# EAGLE design picopter_qc (EAGLE 6.5.0)
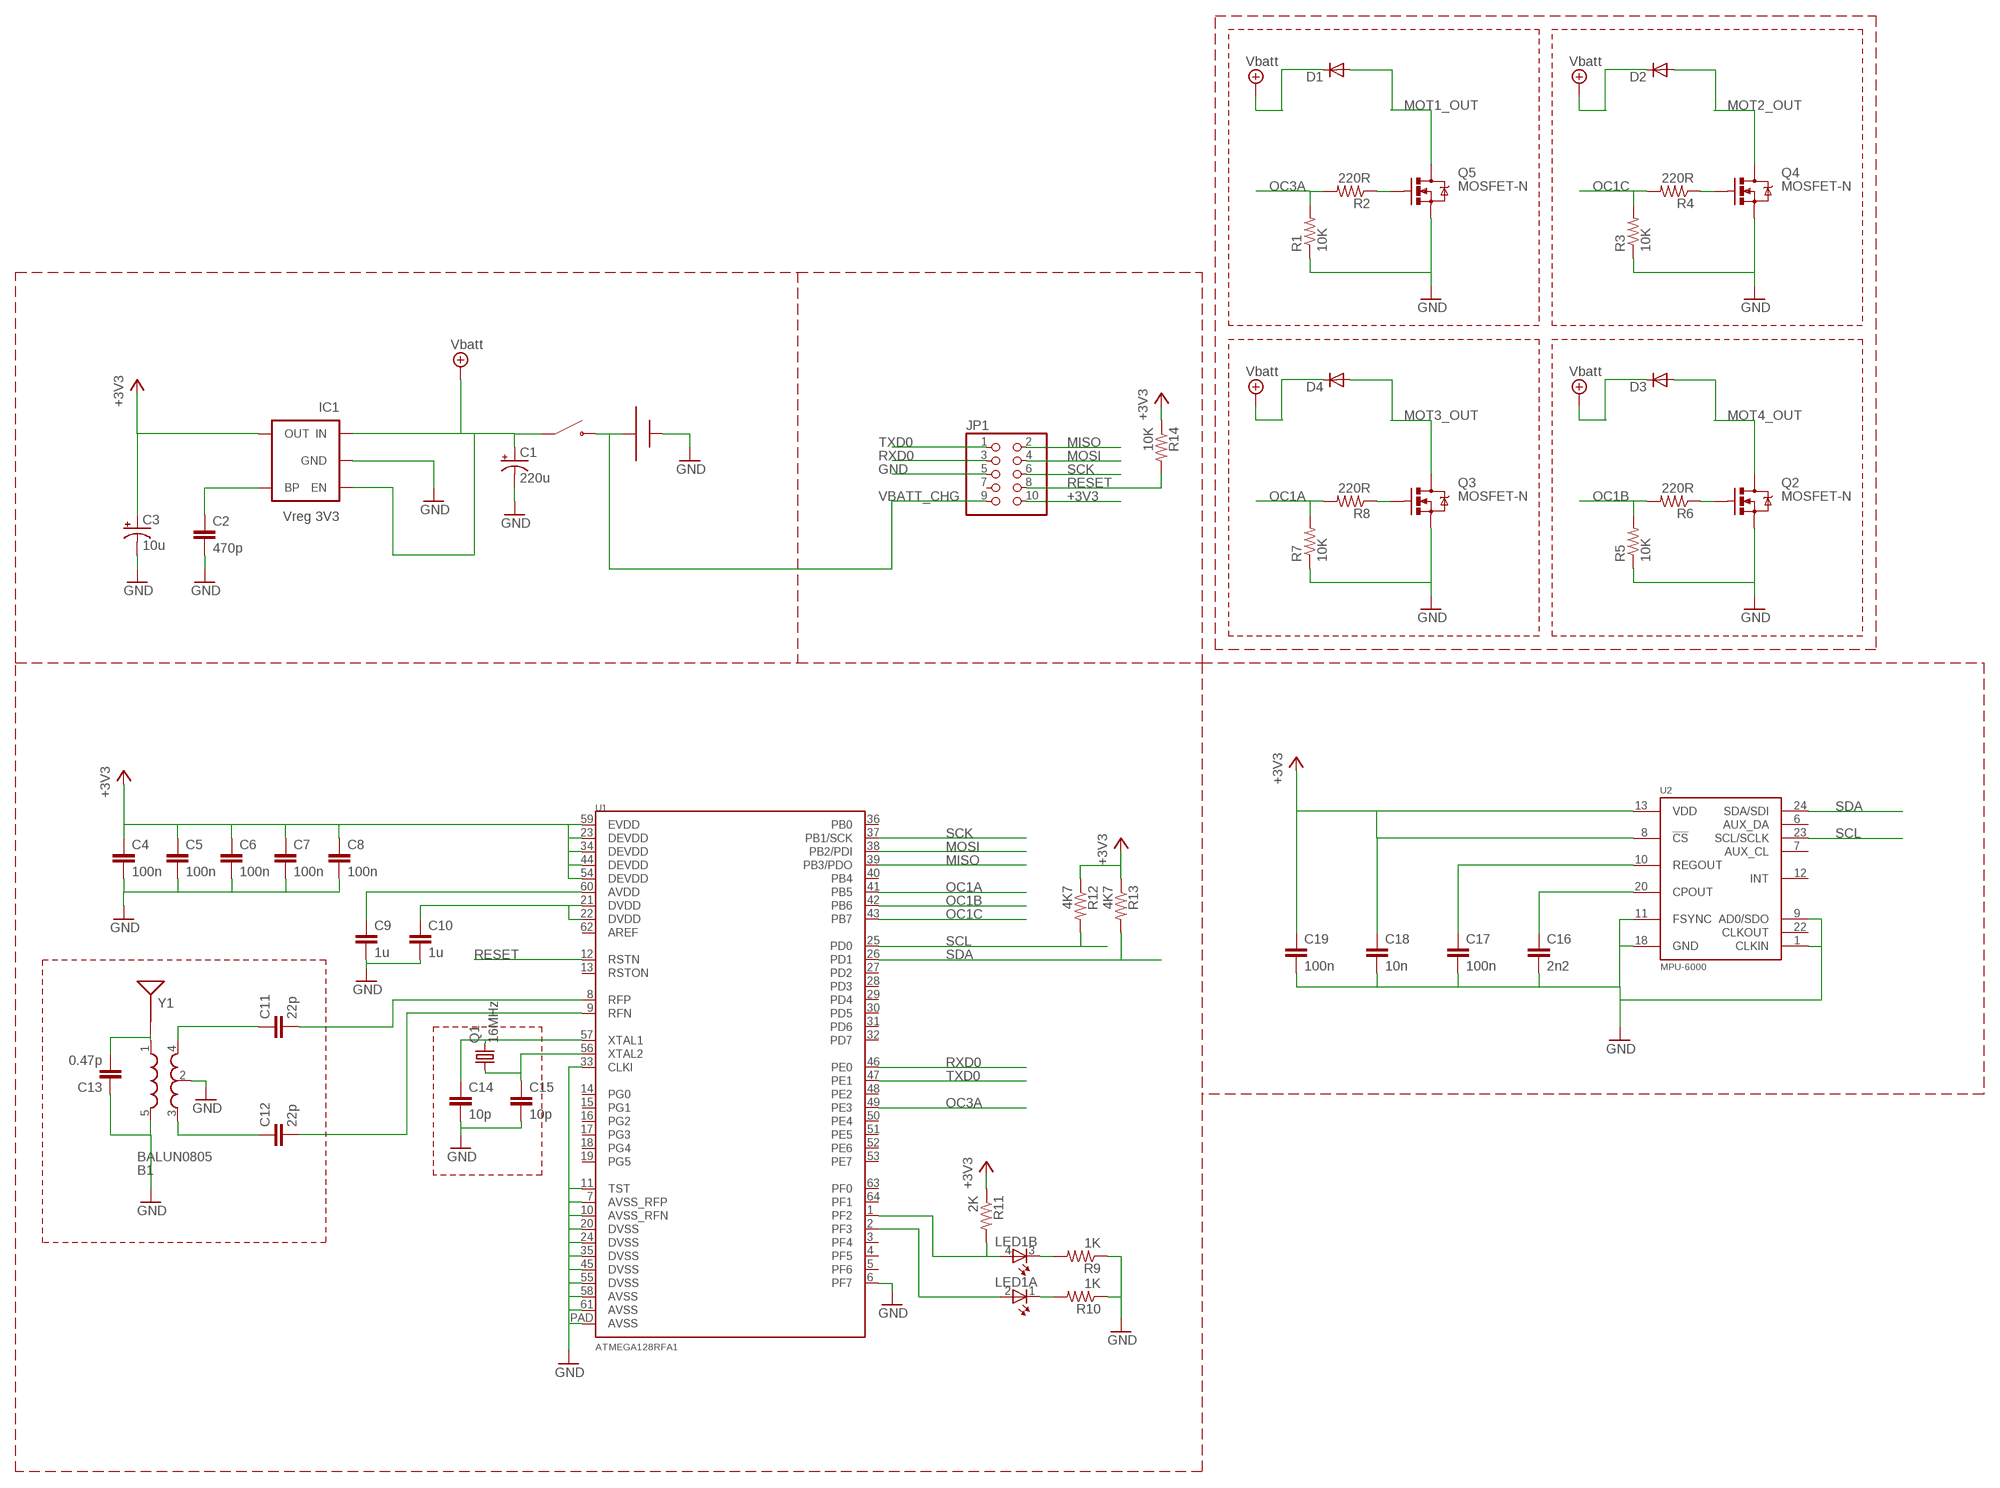
[diagram p0: schematic, sheet 1]

## Parts
B1  BALUN0805  [BALUN]
BATT1  BATT-CONNJST-PH-VERT  [JST-PH-2-VERT]
C1  220u  CPOL-USSMCB  [SMC_B]
C2  470p  C-EUC0603  [C0603]
C3  10u  CPOL-USSMCB  [SMC_B]
C4  100n  C-EUC0603  [C0603]
C5  100n  C-EUC0603  [C0603]
C6  100n  C-EUC0603  [C0603]
C7  100n  C-EUC0603  [C0603]
C8  100n  C-EUC0603  [C0603]
C9  1u  C-EUC0603  [C0603]
C10  1u  C-EUC0603  [C0603]
C11  22p  C-EUC0603  [C0603]
C12  22p  C-EUC0603  [C0603]
C13  0.47p  C-EUC0603  [C0603]
C14  10p  C-EUC0603  [C0603]
C15  10p  C-EUC0603  [C0603]
C16  2n2  C-EUC0603  [C0603]
C17  100n  C-EUC0603  [C0603]
C18  10n  C-EUC0603  [C0603]
C19  100n  C-EUC0603  [C0603]
D1  DIODE-MINIMELF  [MINIMELF]
D2  DIODE-MINIMELF  [MINIMELF]
D3  DIODE-MINIMELF  [MINIMELF]
D4  DIODE-MINIMELF  [MINIMELF]
IC1  Vreg 3V3  V_REG_LDOSMD  [SOT23-5]
JP1  PINHD-2X5EDGE  [2X5-EDGE]
LED1  TOPLED-2-CUSTOM  [TOPLED2CUSTOM]
Q1  16MHz  CRYSTALCTS406  [CTS406]
Q2  MOSFET-N  MOSFET-NCHANNELSMD  [SOT23-3]
Q3  MOSFET-N  MOSFET-NCHANNELSMD  [SOT23-3]
Q4  MOSFET-N  MOSFET-NCHANNELSMD  [SOT23-3]
Q5  MOSFET-N  MOSFET-NCHANNELSMD  [SOT23-3]
R1  10K  R-US_R0603  [R0603]
R2  220R  R-US_R0603  [R0603]
R3  10K  R-US_R0603  [R0603]
R4  220R  R-US_R0603  [R0603]
R5  10K  R-US_R0603  [R0603]
R6  220R  R-US_R0603  [R0603]
R7  10K  R-US_R0603  [R0603]
R8  220R  R-US_R0603  [R0603]
R9  1K  R-US_R0603  [R0603]
R10  1K  R-US_R0603  [R0603]
R11  2K  R-US_R0603  [R0603]
R12  4K7  R-US_R0603  [R0603]
R13  4K7  R-US_R0603  [R0603]
R14  10K  R-US_R0603  [R0603]
S2  SWITCH-PWR-SIMPLE  [SWITCH-PWR]
U1  ATMEGA128RFA1  [QFN-64]
U2  MPU-6000  [QFN-24]
Y1  ANTENNA2SMD5  [ANTENNA-CHIP5]

## Nets
+3V3: C3.+ C4.1 C5.1 C6.1 C7.1 C8.1 C18.1 C19.1 IC1.5(OUT) JP1.10 R11.1 R12.1 R13.1 R14.1 U1.23(DEVDD) U1.34(DEVDD) U1.44(DEVDD) U1.54(DEVDD) U1.59(EVDD) U2.8(!CS) U2.13(VDD)
GND: B1.2(GND) B1.5(GND) BATT1.N C1.- C2.2 C3.- C4.2 C5.2 C6.2 C7.2 C8.2 C9.2 C10.2 C13.1 C14.2 C15.2 C16.2 C17.2 C18.2 C19.2 IC1.2(GND) JP1.5 Q2.2(S) Q3.2(S) Q4.2(S) Q5.2(S) R1.1 R3.1 R5.1 R7.1 R9.1 R10.1 U1.6(PF7) U1.7(AVSS_RFP) U1.10(AVSS_RFN) U1.11(TST) U1.20(DVSS) U1.24(DVSS) U1.33(CLKI) U1.35(DVSS) U1.45(DVSS) U1.55(DVSS) U1.58(AVSS) U1.61(AVSS) U1.PAD(AVSS) U2.1(CLKIN) U2.9(AD0/SDO) U2.11(FSYNC) U2.18(GND)
MISO: JP1.2 U1.39(PB3/PDO)
MOSI: JP1.4 U1.38(PB2/PDI)
MOT1_OUT: D1.A Q5.3(D)
MOT2_OUT: D2.A Q4.3(D)
MOT3_OUT: D4.A Q3.3(D)
MOT4_OUT: D3.A Q2.3(D)
MS1: B1.1(IN) C13.2 Y1.FEED(SIGNAL)
N$1: C2.1 IC1.4(BP)
N$2: LED1.4(B:A) R11.2 U1.1(PF2)
N$3: C11.2 U1.8(RFP)
N$4: C10.1 U1.21(DVDD) U1.22(DVDD)
N$5: C9.1 U1.60(AVDD)
N$6: B1.3(OUT1) C12.1
N$7: B1.4(OUT2) C11.1
N$8: C12.2 U1.9(RFN)
N$9: C14.1 Q1.3 U1.57(XTAL1)
N$10: C15.1 Q1.1 U1.56(XTAL2)
N$11: LED1.3(B:C) R9.2
N$12: LED1.1(A:C) R10.2
N$13: LED1.2(A:A) U1.2(PF3)
N$16: C16.1 U2.20(CPOUT)
N$17: C17.1 U2.10(REGOUT)
N$45: Q5.1(G) R2.1
N$46: Q4.1(G) R4.1
N$47: Q2.1(G) R6.1
N$48: Q3.1(G) R8.1
OC1A: R7.2 R8.2 U1.41(PB5)
OC1B: R5.2 R6.2 U1.42(PB6)
OC1C: R3.2 R4.2 U1.43(PB7)
OC3A: R1.2 R2.2 U1.49(PE3)
RESET: JP1.8 R14.2 U1.12(RSTN)
RXD0: JP1.3 U1.46(PE0)
SCK: JP1.6 U1.37(PB1/SCK)
SCL: R12.2 U1.25(PD0) U2.23(SCL/SCLK)
SDA: R13.2 U1.26(PD1) U2.24(SDA/SDI)
TXD0: JP1.1 U1.47(PE1)
VBATT: C1.+ D1.C D2.C D3.C D4.C IC1.1(IN) IC1.3(EN) S2.P$1 ; supply symbol labelled Vbatt
VBATT_CHG: BATT1.P JP1.9 S2.P$2
Unconnected: JP1.7 U1.3(PF4) U1.4(PF5) U1.5(PF6) U1.13(RSTON) U1.14(PG0) U1.15(PG1) U1.16(PG2) U1.17(PG3) U1.18(PG4) U1.19(PG5) U1.27(PD2) U1.28(PD3) U1.29(PD4) U1.30(PD5) U1.31(PD6) U1.32(PD7) U1.36(PB0) U1.40(PB4) U1.48(PE2) U1.50(PE4) U1.51(PE5) U1.52(PE6) U1.53(PE7) U1.62(AREF) U1.63(PF0) U1.64(PF1) U2.6(AUX_DA) U2.7(AUX_CL) U2.12(INT) U2.22(CLKOUT)

## Library data of the parts
B1 = palmquad_alpha:BALUN
BATT1 = palmquad_alpha:BATT-CONN
C1 C3 = rcl:CPOL-US: POLARIZED CAPACITOR, American symbol
C2 C4-C19 = rcl:C-EU: CAPACITOR, European symbol
D1-D4 = palmquad_alpha:DIODE-: DIODE
IC1 = palmquad_alpha:V_REG_LDO: Voltage Regulator LDO Standard 150mA LDO voltage regulator in SOT-23 layout. Micrel part MIC5205. BP (by-pass) pin is used to lower output noise with 470pF cap.
JP1 = palmquad_alpha:PINHD-2X5: PIN HEADER
LED1 = palmquad_alpha:TOPLED-2-: Multi TOPLED® (two color) LG T672, LP T672 LSY T67B LSW T67C LSY T675 LSY T676 LSG T677 LSG T770 Source: http://www.osram.convergy.de/
Q1 = palmquad_alpha:CRYSTAL: CRYSTAL; OC_FARNELL: unknown; OC_NEWARK: unknown
Q2-Q5 = palmquad_alpha:MOSFET-NCHANNEL
R1-R14 = rcl:R-US_: RESISTOR, American symbol
S2 = palmquad_alpha:SWITCH-PWR
U1 = palmquad_alpha:ATMEGA128RFA1
U2 = palmquad_alpha:MPU-6000: ITG-3200 3-axis gyro, digital output, qfn24 package
Y1 = palmquad_alpha:ANTENNA2: Antenna Single endded antenna. Common with smaller chip antennas. CHIP4 package is the GPS Chip Antenna SKU: GPS-08418. CHIP5 package is 2.4GHz chip antenna SKU: WRL-00144.

## Board
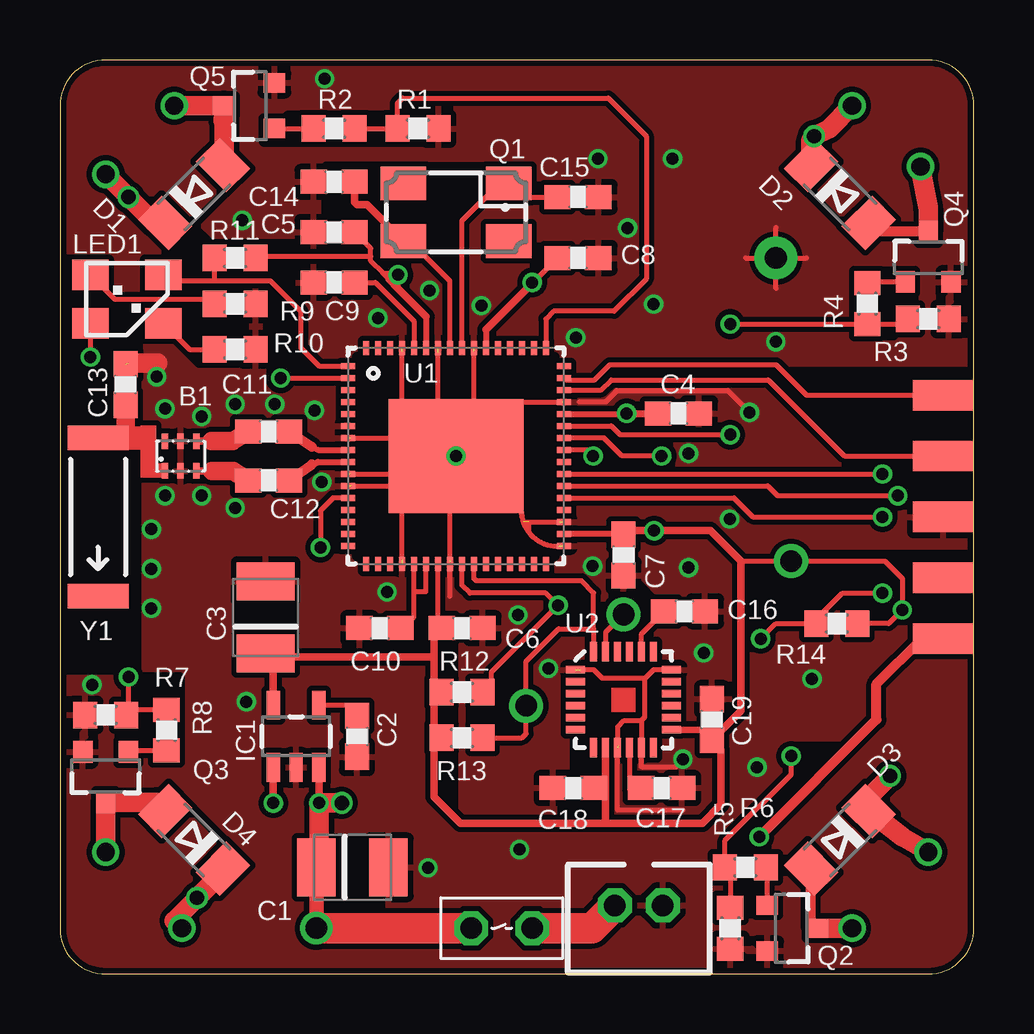
[diagram p1: board, top side]
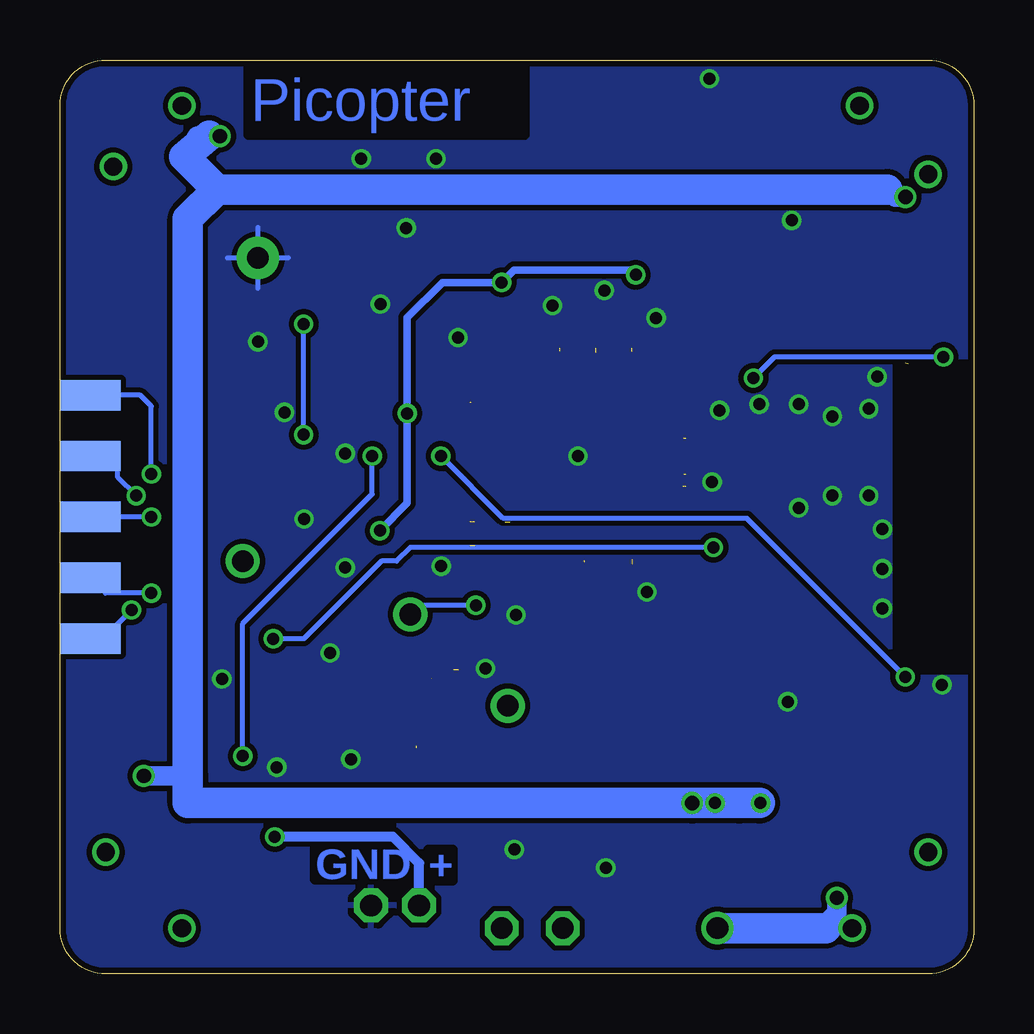
[diagram p2: board, bottom side, seen from below]

Size 38.1 x 38.1 mm. Coordinates in mm from the lower left corner, seen from the top.
Outline: 0,36.2 0,1.88 arc90 1.91,0 36.2,0 arc90 38.1,1.91 38.1,36.2 arc90 36.2,38.1 1.91,38.1 arc90 0,36.2
Copper layers (1*16): Top 0.035mm / dielectric 1.5mm / Bottom 0.035mm
Design rules "fusion_rules_tentedvias": minimum track width 6mil, minimum drill 0.3mm, track to track 7mil, track to pad 7mil, pad to pad 7mil, via to via 7mil, smd to smd 0mil, copper to edge 10mil, drill to drill 10mil, minimum pad ring 10mil, minimum via ring 6mil, stop-mask expansion 2mil, vias tented up to drill 25mil, thermal gap 10mil
tRestrict: area 0,12.7 to 3.2,25.4; area 12.4,17.4 to 20.6,25.7; area 22,10 to 25,12.9; 52 lines
bRestrict: area 0,12.7 to 3.2,25.4

### Footprints (pad centres in the part's own frame; a part is rotated, then mirrored left to right if it is on the bottom)
BALUN = smd 0.27 x 0.635: 1 -0.7,-0.616; 2 -0.05,-0.616; 3 0.6,-0.616; 4 0.6,0.616; 5 -0.05,0.616; 6 -0.7,0.616
JST-PH-2-VERT = drill 0.9 pad 1.422 octagon: N -1,0; P 1,0
SMC_B = smd 1.6 x 2.4: + -1.5,0; - 1.5,0
C0603 = smd 1.1 x 1: 1 -0.85,0; 2 0.85,0
MINIMELF = smd 1.4 x 1.8: A 1.7,0; C -1.7,0
SOT23-5 = smd 0.55 x 1.2: 1 -0.95,-1.3; 2 0,-1.3; 3 0.95,-1.3; 4 0.95,1.3; 5 -0.95,1.3
2X5-EDGE = smd 2.54 x 1.27: 1 0,5.08; 3 0,2.54; 5 0,0; 7 0,-2.54; 9 0,-5.08 | smd 2.54 x 1.27 bottom: 2 0,5.08; 4 0,2.54; 6 0,0; 8 0,-2.54; 10 0,-5.08
TOPLED2CUSTOM = smd 1.27 x 1.524: 1 -1.016,-1.524; 2 -1.016,1.524; 3 1.016,1.524; 4 1.016,-1.524
CTS406 = smd 1.9 x 1.4: 1 -2.2,-1.2; 2 2.2,-1.2; 3 2.2,1.2; 4 -2.2,1.2
SOT23-3 = smd 0.8 x 0.9: 1 -0.95,-1; 2 0.95,-1; 3 0,1.1
R0603 = smd 1 x 1.1: 1 -0.85,0; 2 0.85,0
SWITCH-PWR = drill 0.9 octagon: P$1 -1.27,0; P$2 1.27,0
QFN-64 = smd 0.6 x 0.25: 1 -4.5,3.75; 2 -4.5,3.25; 3 -4.5,2.75; 4 -4.5,2.25; 5 -4.5,1.75; 6 -4.5,1.25; 7 -4.5,0.75; 8 -4.5,0.25; 9 -4.5,-0.25; 10 -4.5,-0.75; 11 -4.5,-1.25; 12 -4.5,-1.75; 13 -4.5,-2.25; 14 -4.5,-2.75; 15 -4.5,-3.25; 16 -4.5,-3.75; 33 4.5,-3.75; 34 4.5,-3.25; 35 4.5,-2.75; 36 4.5,-2.25; 37 4.5,-1.75; 38 4.5,-1.25; 39 4.5,-0.75; 40 4.5,-0.25; 41 4.5,0.25; 42 4.5,0.75; 43 4.5,1.25; 44 4.5,1.75; 45 4.5,2.25; 46 4.5,2.75; 47 4.5,3.25; 48 4.5,3.75 | smd 0.25 x 0.6: 17 -3.75,-4.5; 18 -3.25,-4.5; 19 -2.75,-4.5; 20 -2.25,-4.5; 21 -1.75,-4.5; 22 -1.25,-4.5; 23 -0.75,-4.5; 24 -0.25,-4.5; 25 0.25,-4.5; 26 0.75,-4.5; 27 1.25,-4.5; 28 1.75,-4.5; 29 2.25,-4.5; 30 2.75,-4.5; 31 3.25,-4.5; 32 3.75,-4.5; 49 3.75,4.5; 50 3.25,4.5; 51 2.75,4.5; 52 2.25,4.5; 53 1.75,4.5; 54 1.25,4.5; 55 0.75,4.5; 56 0.25,4.5; 57 -0.25,4.5; 58 -0.75,4.5; 59 -1.25,4.5; 60 -1.75,4.5; 61 -2.25,4.5; 62 -2.75,4.5; 63 -3.25,4.5; 64 -3.75,4.5 | smd 5.639 x 4.75: PAD 0,0
QFN-24 = smd 0.8 x 0.3: 1 -2,1.25; 2 -2,0.75; 3 -2,0.25; 4 -2,-0.25; 5 -2,-0.75; 6 -2,-1.25; 13 2,-1.25; 14 2,-0.75; 15 2,-0.25; 16 2,0.25; 17 2,0.75; 18 2,1.25 | smd 0.3 x 0.8: 7 -1.25,-2; 8 -0.75,-2; 9 -0.25,-2; 10 0.25,-2; 11 0.75,-2; 12 1.25,-2; 19 1.25,2; 20 0.75,2; 21 0.25,2; 22 -0.25,2; 23 -0.75,2; 24 -1.25,2
ANTENNA-CHIP5 = smd 1.016 x 2.54: FEED -3.302,0; NC 3.302,0

### Placement (x,y rotation side)
B1  5.08,21.59 0 top
BATT1  24.13,2.86 180 top
C1  12.19,4.45 0 top
C2  12.38,9.91 270 top
C3  8.57,14.86 90 top
C4  25.78,23.37 0 top
C5  11.43,30.92 180 top
C6  16.76,14.41 0 top
C7  23.5,17.46 270 top
C8  21.59,29.84 0 top
C9  11.43,28.83 180 top
C10  13.34,14.41 180 top
C11  8.7,22.61 0 top
C12  8.7,20.57 0 top
C13  2.73,24.57 270 top
C14  11.43,33.02 180 top
C15  21.59,32.38 0 top
C16  26.04,15.11 0 top
C17  25.08,7.75 0 top
C18  21.4,7.75 180 top
C19  27.18,10.6 90 top
D1  5.59,32.51 45 top
D2  32.51,32.51 315 top
D3  32.51,5.59 225 top
D4  5.59,5.59 135 top
IC1  9.84,9.91 0 top
JP1  36.83,19.05 0 top
LED1  2.79,28.13 90 top
Q1  16.51,31.75 180 top
Q2  30.48,1.91 270 top
Q3  1.91,8.26 180 top
Q4  36.2,29.84 0 top
Q5  7.94,36.2 90 top
R1  14.92,35.24 180 top
R2  11.43,35.24 0 top
R3  36.2,27.3 180 top
R4  33.66,27.94 270 top
R5  27.94,1.91 90 top
R6  28.57,4.45 180 top
R7  1.91,10.79 0 top
R8  4.45,10.16 90 top
R9  7.3,27.94 180 top
R10  7.3,26.04 180 top
R11  7.3,29.84 180 top
R12  16.76,11.75 0 top
R13  16.76,9.84 0 top
R14  32.38,14.61 180 top
S2  18.41,1.91 0 top
U1  16.51,21.59 0 top
U2  23.5,11.43 0 top
U$1  [PICOPTER-LOGO]  30.16,35.56 0 bottom
U$5  [ARM-MOCK]  35.24,35.56 45 top
U$6  [ARM-MOCK]  2.54,35.56 135 top
U$7  [ARM-MOCK]  2.54,2.54 225 top
U$8  [ARM-MOCK]  35.56,2.54 315 top
Y1  1.59,19.05 270 top

### Tracks (layer width: path | path; a pad name or v marks a point on that pad's centre or on a via)
+3V3  (via drill 0.5, 0.9 pad 1.42)
  Top 0.203: C5.1 12.95,30.25 12.95,29.91 | 12.95,29.91 12.95,29.72 13.46,29.21 | 13.72,28.96 13.46,29.21 | 23.5,18.34 C7.1 23.66,18.48 | U1.23 15.76,14.61 C6.1 | 22.75,7.68 C18.1 | 26.75,10.18 C19.1 27.18,9.34 27.56,9.34 | 24.93,23.34 C4.1 | v19.68,28.83 19.72,28.83 C8.1 | 28.38,17.21 v30.48,17.21 34.39,17.21 35.12,16.48 v35.12,15.18 34.54,14.61 R14.1 | R11.1 8.22,29.91 12.95,29.91 | 13.46,29.21 13.97,29.21 | 15.6,11.81 15.66,11.75 R12.1 | 15.6,9.74 15.6,9.62
  Top 0.254: 17.76,26.86 U1.54 | 15.26,27.41 U1.59 | 23.5,18.34 U1.34 | U1.44 24.93,23.34 | 14.1,28.57 14.1,29.02 | C4.1 v23.62,23.37
  Top 0.279: 26.75,10.18 U2.13 | U2.8 22.75,7.68
  Top 0.305: 19.72,28.83 17.76,26.86 | 15.26,27.41 14.1,28.57 13.72,28.96 13.91,29.15 v14.1,29.15 | 27.56,9.34 27.56,7.06 26.78,6.29 22.75,6.29 | 23.66,18.48 v24.77,18.48 27.11,18.48 28.38,17.21 28.38,10.96 C19.1 | 15.76,14.61 15.6,14.54 15.6,13.21 | 8.89,13.21 8.89,13.36 C3.+ 8.89,13.04 | 8.89,13.21 15.6,13.21 | IC1.5 8.89,10.82 8.89,13.21 | 22.75,6.29 U2.8 | 15.6,13.21 15.6,12 R12.1 | 22.75,6.29 16.69,6.29 15.6,7.38 15.6,9.62 R13.1 | 15.6,11.81 15.6,9.74
  Bottom 0.203: v23.62,23.37 23.59,23.34 | v24.77,18.48 24.83,18.48 | v35.12,15.18 36.32,13.97 JP1.10
  Bottom 0.305: v14.1,29.15 14.29,29.34 19.18,29.34 v19.68,28.83 22.16,28.83 23.62,27.37 v23.62,23.37 23.62,19.62 v24.77,18.48
GND  (via drill 0.5)  (16 unrouted)
  Top 0.203: 14.26,17.27 14.26,19.46 | 16.26,17.23 16.26,19.41 | 18.77,23.84 20.96,23.84 | 17.27,23.77 17.27,25.95 | 15.76,23.72 15.76,25.91 | 14.26,23.75 14.26,25.93 | 12.09,20.84 14.27,20.84 | 12.14,20.34 14.33,20.34 | 12.11,22.34 14.3,22.34 | 20.8,17.83 20.73,17.83 arc-90 19.23,19.33 | 19.33,18.84 20.82,18.84 | 24.24,10.57 24.24,9.58 | 24.24,10.57 24.38,10.71 24.38,12.32 | 24.38,12.32 22.62,12.32 | 23.25,9.5 23.25,10.3 23.52,10.57 24.24,10.57 | 25.3,12.69 24.75,12.69 24.38,12.32 | 21.69,12.68 22.25,12.68 22.61,12.32 | 19.56,18.4 19.56,18.83 | 16.26,15.75 16.26,17.18 | 28.57,29.84 31.11,29.84 | 29.84,28.57 29.84,31.11 | 21.65,23.84 22.73,23.84 23.21,24.32 27.84,24.32 28.73,23.43 | 24.24,9.21 24.24,8.63 25.71,8.63 | U2.9 23.25,6.83 25.98,6.83
  Top 0.813: 2.86,25.46 4.06,25.46
  Bottom 0.203: 28.57,29.84 31.11,29.84 | 29.84,28.57 29.84,31.11
  other vias: 5.91,23.24 4.03,24.89 5.91,19.94 4.38,19.94 4.38,23.56 10.91,20.51 15.41,28.49 17.57,27.86 13.25,27.35 25.97,8.95 7.3,23.75 7.3,19.43 23.66,31.1 29.06,8.62 26.84,13.38 20.36,12.73 1.33,12.06 15.35,4.43 22.2,17 13.63,15.92 26.2,16.94 27.92,18.97 19.09,14.97 28.74,23.41 26.2,21.7 21.51,26.52 3.81,18.54 3.81,16.89 19.16,5.19 7.76,11.35 24.74,27.92 16.51,21.59 8.95,23.75 10.6,23.5 3.81,15.24 25.54,33.99 22.43,33.99 11.03,37.32 7.6,31.41 31.35,12.3 29.84,26.35
  pour Top (isolate 0.216): -0.32,38.42 38.1,38.42 38.1,29.21 38.1,8.89 38.1,-0.32 -0.32,-0.32
  pour Bottom (isolate 0.216): -0.32,38.42 38.1,38.42 38.1,29.21 38.1,8.89 38.1,-0.32 -0.32,-0.32
MISO  (via drill 0.5)
  Top 0.203: U1.39 v34.29,20.84
  Bottom 0.203: v34.29,20.84 34.29,23.67 34.75,24.13 JP1.2
MOSI  (via drill 0.5)
  Top 0.203: U1.38 29.51,20.34 29.91,19.94 v34.92,19.94
  Bottom 0.203: v34.92,19.94 35.69,20.7 35.69,21.02 36.26,21.59 JP1.4
MOT1_OUT  (via drill 0.76)
  Top 0.813: 6.81,35.56 Q5.3 | Q5.3 6.84,33.76 D1.A | v4.76,36.2 Q5.3
MOT2_OUT  (via drill 0.76)
  Top 0.406: Q4.3 33.71,30.95 D2.A
  Top 0.813: Q4.3 36.2,31.92 35.88,33.51 v35.88,33.66
MOT3_OUT  (via drill 0.76)
  Top 0.635: Q3.3 2.54,7.13
  Top 0.813: D4.A 4.02,7.16 Q3.3 v1.91,5.08
MOT4_OUT  (via drill 0.76)
  Top 0.406: Q2.3 31.31,1.91 D3.A
  Top 0.635: 31.9,1.91 31.92,1.91
  Top 0.813: v33.02,1.91 31.9,1.91 Q2.3
MS1
  Top 0.203: 2.73,22.35 2.98,22.35 3.68,21.65 3.68,20.97 B1.1
  Top 0.762: C13.2 2.73,22.35 Y1.FEED
N$1
  Top 0.203: IC1.4 11.93,11.21 C2.1
N$2
  Top 0.203: U1.1 10.8,25.34 10.03,26.1 10.03,27.62 8.76,28.89 6.45,28.89 | LED1.4 4.32,28.89 6.45,28.89 | 6.45,28.89 R11.2
N$3
  Top 0.254: U1.8 10.75,21.84 10.5,21.97
  Top 0.406: C11.2 10.5,21.97
N$4
  Top 0.203: C10.1 14.76,14.86 14.76,15.94 | 14.76,15.94 U1.21 | U1.22 15.26,15.94 14.76,15.94
N$5
  Top 0.203: C9.1 13.16,28.83 14.76,27.23 U1.60
N$6
  Top 0.254: 6.01,20.97 6.33,20.97 6.35,20.95
  Top 0.305: B1.3 6.01,20.97
  Top 0.762: 6.35,20.95 7.21,20.95 C12.1
N$7
  Top 0.305: B1.4 6.33,22.21
  Top 0.762: 6.33,22.21 7.2,22.21 C11.1
N$8
  Top 0.254: 10.5,21.24 10.75,21.34 U1.9
  Top 0.406: C12.2 10.5,21.24
N$9
  Top 0.203: U1.57 16.26,28.89 14.6,30.55 Q1.3
  Top 0.305: C14.1 12.28,32.17 12.38,32.07 12.79,32.07 Q1.3
N$10
  Top 0.203: U1.56 16.76,31.39 18.32,32.95 Q1.1 arc90 19.27,32.38 C15.1
N$11
  Top 0.203: LED1.3 2.29,28.13 6.45,28.13 R9.2
N$12
  Top 0.203: LED1.1 5.4,26.04 R10.2
N$13  (via drill 0.5)
  Top 0.203: LED1.2 v1.27,25.72 | v9.2,24.84 U1.2
  Bottom 0.203: v1.27,25.72 8.32,25.72 v9.2,24.84
N$14  (via drill 0.9 pad 1.78)
  other vias: 29.84,29.84
N$16
  Top 0.203: U2.20 24.25,14.17 C16.1
N$17
  Top 0.203: U2.10 23.75,7.68 C17.1
N$45
  Top 0.203: Q5.1 R2.1
N$46
  Top 0.203: R4.1 33.71,28.84 Q4.1
N$47
  Top 0.203: R6.1 arc-90 29.48,4.39 Q2.1
N$48
  Top 0.203: Q3.1 2.91,9.31 R8.1
OC1A  (via drill 0.5)
  Top 0.203: U1.41 21.98,21.84 v22.23,21.59 | v2.86,12.38 2.86,10.9 R7.2 2.97,11.01 R8.2
  Bottom 0.203: v2.86,12.38 9.46,18.99 19.62,18.99 v22.23,21.59
OC1B  (via drill 0.5)
  Top 0.203: U1.42 22.68,22.34 23.43,21.59 v25.08,21.59 | R5.2 27.94,4.23 R6.2 27.73,5.56 30.48,8.32 v30.48,9.08
  Bottom 0.203: v25.08,21.59 25.08,20 30.48,14.61 v30.48,9.08
OC1C  (via drill 0.5)
  Top 0.203: U1.43 22.99,22.84 23.35,22.48 v27.94,22.48 | R3.2 35.13,27.09 R4.2 v27.94,27.09
  Bottom 0.203: v27.94,22.48 v27.94,27.09
OC3A
  Top 0.203: R2.2 R1.2 14.07,36.3 14.29,36.51 22.86,36.51 24.45,34.92 24.45,28.97 23.1,27.62 20.58,27.62 20.26,27.3 U1.49
RESET  (via drill 0.5)
  Top 0.203: U1.12 11.38,19.84 10.86,19.31 v10.86,17.78 | v34.29,15.88 32.62,15.88 31.54,14.79 R14.2 29.84,14.61 v29.21,13.97
  Bottom 0.203: v10.86,17.78 23.5,17.78 24.07,17.21 24.7,17.21 27.94,13.97 v29.21,13.97 | v34.29,15.88 36.2,15.88 JP1.8
RXD0
  Top 0.203: U1.46 22.56,24.34 22.99,24.77 29.53,24.77 32.7,21.59 JP1.3
SCK  (via drill 0.5)
  Top 0.203: U1.37 28.1,19.84 28.89,19.05 v34.29,19.05
  Bottom 0.203: v34.29,19.05 JP1.6
SCL  (via drill 0.5, 0.9 pad 1.42)
  Top 0.203: U1.25 16.76,16.2 17.09,15.88 20.26,15.88 v20.77,15.37 18,12.6 18,11.75 R12.2 | U2.23 22.75,14.24 v23.5,14.99
  Bottom 0.203: v20.77,15.37 23.11,15.37 v23.5,14.99
SDA  (via drill 0.9 pad 1.42)
  Top 0.203: 22.25,14.38 22.25,15.89 21.75,16.38 17.36,16.38 17.26,16.48 U1.26 | 22.25,14.38 U2.24 | 17.36,9.94 R13.2 19.26,9.84 19.43,10.01 v19.43,11.18 19.43,13.03 20.78,14.38 22.25,14.38
TXD0
  Top 0.203: U1.47 21.09,24.77 22.29,24.77 22.92,25.4 29.84,25.4 31.11,24.13 JP1.1
VBATT  (via drill 0.5, 0.6, 0.76, 0.9)
  Top 0.305: v8.89,7.13 IC1.1 | v10.79,7.13 IC1.3
  Top 0.61: v10.69,1.91 C1.+
  Top 0.813: v34.61,8.26 33.71,7.36 D3.C 35.11,5.71 v36.2,5.08 | D4.C 6.79,4.25 v5.71,3.17 4.76,2.22 v5.08,1.91 | C1.+ 10.79,4.54 v10.79,7.13 v11.75,7.13 | D1.C 3.93,31.31 v2.86,32.38 v1.91,33.34 | D2.C 31.31,34.73 v31.43,34.92 32.07,35.24 v33.02,36.2
  Top 1.27: v10.69,1.91 S2.P$1
  Bottom 0.203: v8.89,7.13 9.54,6.86 9.78,7.13
  Bottom 0.813: v34.61,8.26 32.77,8.26 | v5.71,3.17 5.71,2.54 6.35,1.91 | v2.86,32.38 3.28,32.38 3.6,32.7 | v31.43,34.92 32.38,34.92 32.92,34.07
  Bottom 1.27: 8.92,7.13 9.78,7.13 v11.75,7.13 32.77,7.13 32.77,8.26 32.77,31.48 31.55,32.7 | 6.18,1.91 6.35,1.91 v10.69,1.91 | 31.55,32.7 3.6,32.7 | 31.55,32.7 32.92,34.07 31.89,34.95
VBATT_CHG  (via drill 0.5)
  Top 0.406: v29.15,5.71 34.04,10.6 34.04,12.09 35.92,13.97 JP1.9
  Top 1.27: S2.P$2 22.18,1.91 BATT1.P
  Bottom 0.406: v29.15,5.71 24.22,5.71 23.13,4.62 BATT1.P
(copper drawn outside any net)
  shapes: Top area x3

### Text on the board
Bottom: + | GND
_tsilk: SER> | SER< | GND | + | Vbatt | BAT | + | SW | +
_bsilk: MISO | MOSI | SCK | RST | +3V3